# Altium schematic sheet dtb219-schematic.SchDoc
size A; SheetNumber: 1; SheetTotal: 1
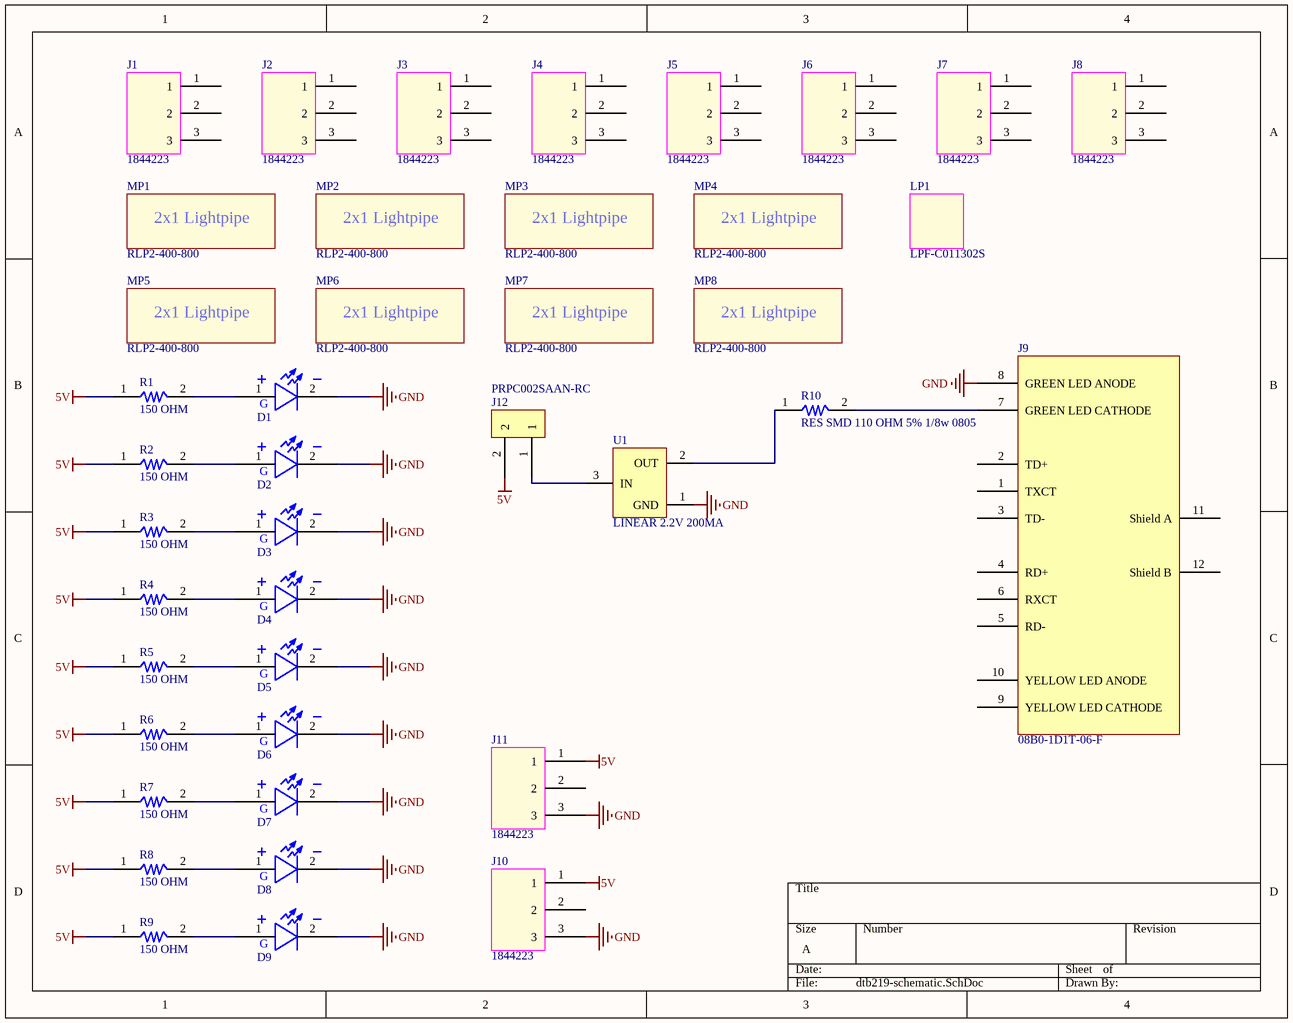
[diagram p0: dtb219-schematic.SchDoc]

## Parts
D1  Green LED Clear SMD  [LTST-C19X]  (value not drawn)
D2  Green LED Clear SMD  [LTST-C19X]  (value not drawn)
D3  Green LED Clear SMD  [LTST-C19X]  (value not drawn)
D4  Green LED Clear SMD  [LTST-C19X]  (value not drawn)
D5  Green LED Clear SMD  [LTST-C19X]  (value not drawn)
D6  Green LED Clear SMD  [LTST-C19X]  (value not drawn)
D7  Green LED Clear SMD  [LTST-C19X]  (value not drawn)
D8  Green LED Clear SMD  [LTST-C19X]  (value not drawn)
D9  Green LED Clear SMD  [LTST-C19X]  (value not drawn)
J1  1844223  [1844223]
J2  1844223  [1844223]
J3  1844223  [1844223]
J4  1844223  [1844223]
J5  1844223  [1844223]
J6  1844223  [1844223]
J7  1844223  [1844223]
J8  1844223  [1844223]
J9  08B0-1D1T-06-F  [08B0-1D1T-06-F]
J10  1844223  [1844223]
J11  1844223  [1844223]
J12  PRPC002SAAN-RC  [PRPC002SAAN-RC]
LP1  LPF-C011302S  [LPF-C011302S]
MP1  RLP2-400-800  [RLP2-400-800]
MP2  RLP2-400-800  [RLP2-400-800]
MP3  RLP2-400-800  [RLP2-400-800]
MP4  RLP2-400-800  [RLP2-400-800]
MP5  RLP2-400-800  [RLP2-400-800]
MP6  RLP2-400-800  [RLP2-400-800]
MP7  RLP2-400-800  [RLP2-400-800]
MP8  RLP2-400-800  [RLP2-400-800]
R1  150 OHM  [0805 Footprint]
R2  150 OHM  [0805 Footprint]
R3  150 OHM  [0805 Footprint]
R4  150 OHM  [0805 Footprint]
R5  150 OHM  [0805 Footprint]
R6  150 OHM  [0805 Footprint]
R7  150 OHM  [0805 Footprint]
R8  150 OHM  [0805 Footprint]
R9  150 OHM  [0805 Footprint]
R10  RES SMD 110 OHM 5% 1/8w 0805  [0805 Footprint]
U1  LINEAR 2.2V 200MA  [SOT23-3]

## Nets
5V: J10.1 J11.1 J12.2 R1.1 R2.1 R3.1 R4.1 R5.1 R6.1 R7.1 R8.1 R9.1
GND: D1.2 D2.2 D3.2 D4.2 D5.2 D6.2 D7.2 D8.2 D9.2 J9.8(GREEN_LED_ANODE) J10.3 J11.3 U1.1(GND)
NetD1_1: D1.1 R1.2
NetD2_1: D2.1 R2.2
NetD3_1: D3.1 R3.2
NetD4_1: D4.1 R4.2
NetD5_1: D5.1 R5.2
NetD6_1: D6.1 R6.2
NetD7_1: D7.1 R7.2
NetD8_1: D8.1 R8.2
NetD9_1: D9.1 R9.2
NetJ9_7: J9.7(GREEN_LED_CATHODE) R10.2
NetJ12_1: J12.1 U1.3(IN)
NetR10_1: R10.1 U1.2(OUT)

Not connected (* = marked no-connect by the designer): J1 1 2 3; J2 1 2 3; J3 1 2 3; J4 1 2 3; J5 1 2 3; J6 1 2 3; J7 1 2 3; J8 1 2 3; J9 1(TXCT) 2(TD+) 3(TD-) 4(RD+) 5(RD-) 6(RXCT) 9(YELLOW_LED_CATHODE) 10(YELLOW_LED_ANODE) 11(Shield_A) 12(Shield_B); J10 2; J11 2

## Notes on the sheet
- (in symbol LED Green) G
- (in symbol RLP2-400-800) 2x1 Lightpipe

## Library data of the parts
D1-D9 = LED Green: Green 571nm LED Indication - Discrete 2V 0603 (1608 Metric); Manufacturer: Lite-On Inc.; Manufacturer PN: LTST-C191KGKT; Vendor: Digikey; Vendor PN: 160-1446-2-ND; Value: Green LED
J1-J8 J10 J11 = 1844223: 3 Position Terminal Block Header, Male Pins, Shrouded (4 Side) 0.138" (3.50mm) 90°, Right Angle Through Hole; Manufacturer: Phoenix Contact; Vendor: Digikey; Vendor PN: 277-2415-ND; VoltServer PN: CON-00009; Manufacturer PN: 1844223
J9 = 08B0-1D1T-06-F: CONN MAGJACK 1PORT 100 BASE-T; Manufacturer: Bel Fuse Inc; Vendor: Digikey; Vendor PN: 507-1441-ND; Manufacturer PN: 08B0-1D1T-06-F
J12 = PRPC002SAAN-RC: CONN HEADER .100" SNGL STR 2POS; Manufacturer: Sullins Connector Solutions; Vendor: Digikey; Vendor PN: S1011EC-02-ND; VoltServer PN: CON-00043; Manufacturer PN: PRPC002SAAN-RC
LP1 = LPF-C011302S: Light Pipe Single Clear Rigid Round with Flat Top, 3mm Board Mount, Press Fit, Right Angle; Manufacturer: Lumex Opto/Components Inc.; Vendor: Digikey; Vendor PN: 67-1846-ND; VoltServer PN: LPG-00002; Manufacturer PN: LPF-C011302S
MP1-MP8 = RLP2-400-800: Light Pipe 2 Wide Clear Rigid Round with Flat Top, 2.8mm Board Mount, Snap-In, Right Angle; Manufacturer: Bivar; Vendor: Digikey; Vendor PN: 492-1448-ND; Manufacturer PN: RLP2-400-800
R1-R9 = ERJ-P06J151V: 150 Ohms ±5% 0.5W, 1/2W Chip Resistor 0805 (2012 Metric); Manufacturer: Panasonic Electionic Components; Value: 150 Ohm 5%, 1/2W; Vendor: Digi-Key; Vendor PN: P150ADTR-ND; Manufacturer PN: ERJ-P06J151V
R10 = ERJ-6GEYJ111V: 110 Ohms ±5% 0.125W, 1/8W Chip Resistor 0805 (2012 Metric) Automotive AEC-Q200 Thick Film; Manufacturer: Panasonic Electionic Components; Value: 110 Ohm 5%, 1/8W; Vendor: Digi-Key; Vendor PN: P110ATR-ND; Manufacturer PN: ERJ-6GEYJ111V
U1 = TPS7A0522PDBZR: Linear Voltage Regulator IC Positive Fixed 1 Output 200mA SOT-23-3; Manufacturer: Texas Instruments; Vendor: Digi-Key; Vendor PN: 296-TPS7A0522PDBZRTR-ND; Manufacturer PN: TPS7A0522PDBZR; Value: LINEAR 2.2V 200MA